# Altium schematic sheet Connect.SchDoc
size A4; SheetNumber: 4; SheetTotal: 4
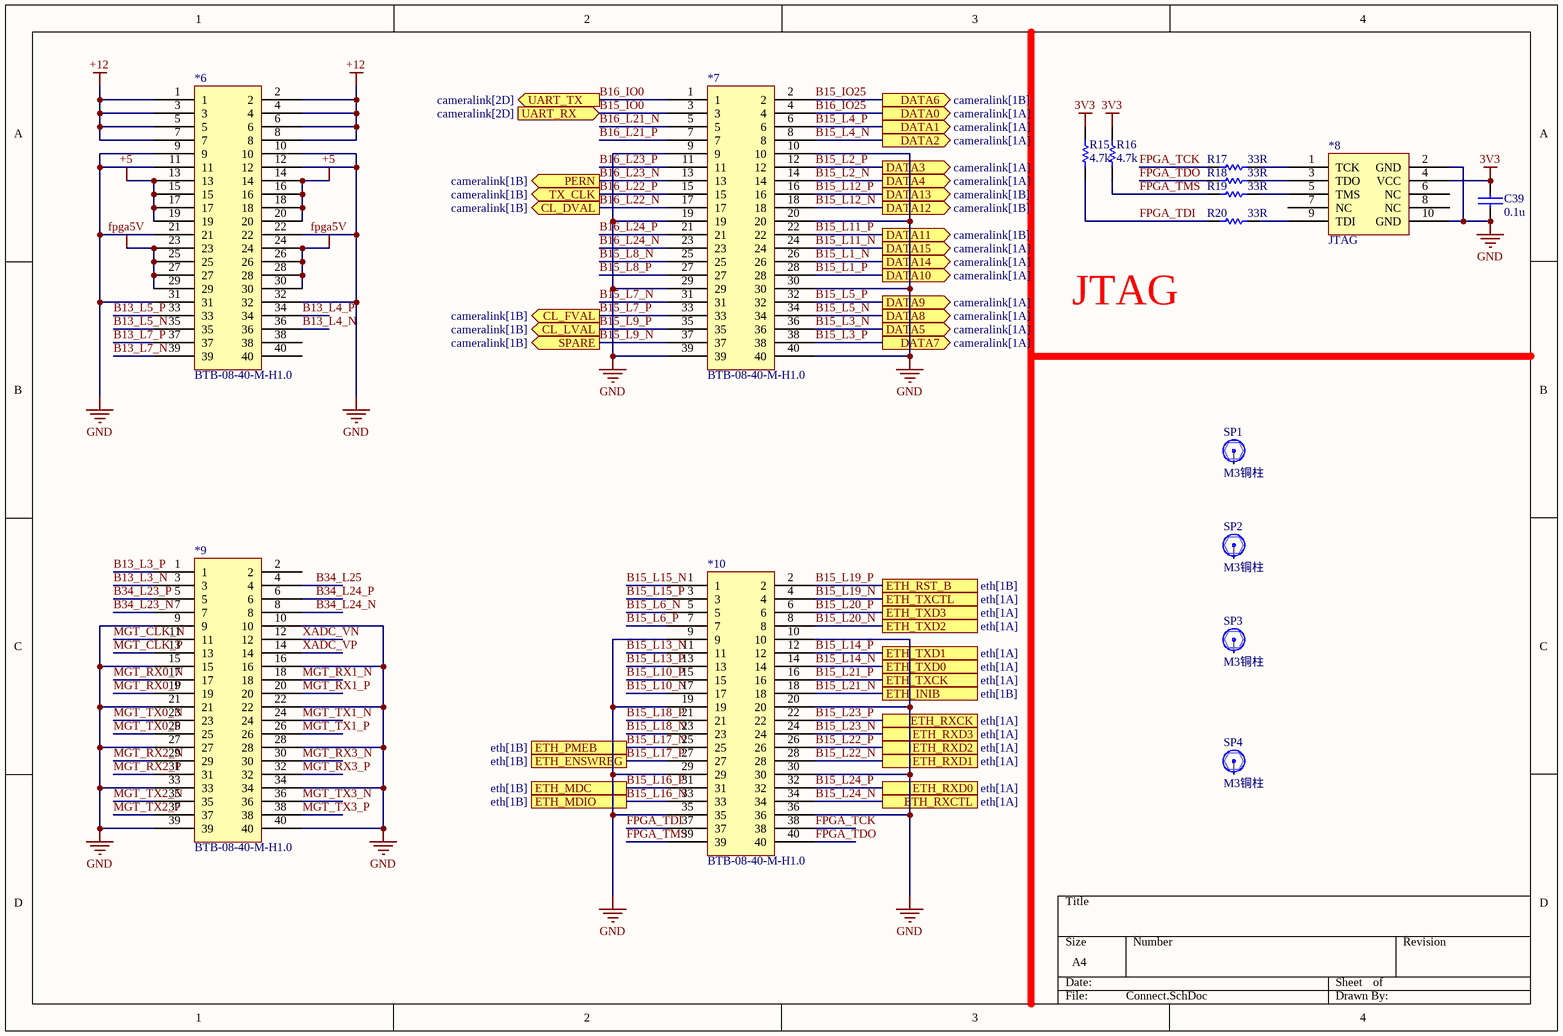
[diagram p0: Connect.SchDoc]

## Parts
*6  BTB-08-40-M-H1.0  [BTB-08-40-M-H1.0]
*7  BTB-08-40-M-H1.0  [BTB-08-40-M-H1.0]
*8  JTAG  [IDC-TH_10P-P2.54-H-R2-C5-S2.54]
*9  BTB-08-40-M-H1.0  [BTB-08-40-M-H1.0]
*10  BTB-08-40-M-H1.0  [BTB-08-40-M-H1.0]
C39  0.1u  [0603C]
R15  4.7k  [0603R]
R16  4.7k  [0603R]
R17  33R  [0603R]
R18  33R  [0603R]
R19  33R  [0603R]
R20  33R  [0603R]
SP1  M3铜柱  [M3x4_N]
SP2  M3铜柱  [M3x4_N]
SP3  M3铜柱  [M3x4_N]
SP4  M3铜柱  [M3x4_N]

## Ports
CL_DVAL (out, see cameralink[1B]), CL_FVAL (out, see cameralink[1B]), CL_LVAL (out, see cameralink[1B]), DATA0 (out, see cameralink[1A]), DATA1 (out, see cameralink[1A]), DATA2 (out, see cameralink[1A]), DATA3 (out, see cameralink[1A]), DATA4 (out, see cameralink[1A]), DATA5 (out, see cameralink[1A]), DATA6 (out, see cameralink[1B]), DATA7 (out, see cameralink[1A]), DATA8 (out, see cameralink[1A]), DATA9 (out, see cameralink[1A]), DATA10 (out, see cameralink[1A]), DATA11 (out, see cameralink[1B]), DATA12 (out, see cameralink[1B]), DATA13 (out, see cameralink[1B]), DATA14 (out, see cameralink[1A]), DATA15 (out, see cameralink[1A]), ETH_ENSWREG (see eth[1B]), ETH_INIB (see eth[1B]), ETH_MDC (see eth[1B]), ETH_MDIO (see eth[1B]), ETH_PMEB (see eth[1B]), ETH_RST_B (see eth[1B]), ETH_RXCK (see eth[1A]), ETH_RXCTL (see eth[1A]), ETH_RXD0 (see eth[1A]), ETH_RXD1 (see eth[1A]), ETH_RXD2 (see eth[1A]), ETH_RXD3 (see eth[1A]), ETH_TXCK (see eth[1A]), ETH_TXCTL (see eth[1A]), ETH_TXD0 (see eth[1A]), ETH_TXD1 (see eth[1A]), ETH_TXD2 (see eth[1A]), ETH_TXD3 (see eth[1A]), PERN (out, see cameralink[1B]), SPARE (out, see cameralink[1B]), TX_CLK (out, see cameralink[1B]), UART_RX (in, see cameralink[2D]), UART_TX (out, see cameralink[2D])

## Nets
3V3: *8.4(VCC) C39.2 R15.2 R16.2
+5: *6.13 *6.14 *6.15 *6.16 *6.17 *6.18 *6.19 *6.20
+12: *6.1 *6.2 *6.3 *6.4 *6.5 *6.6 *6.7 *6.8
fpga5V: *6.23 *6.24 *6.25 *6.26 *6.27 *6.28 *6.29 *6.30
GND: *6.9 *6.10 *6.11 *6.12 *6.21 *6.22 *6.31 *6.32 *7.9 *7.10 *7.19 *7.20 *7.29 *7.30 *7.39 *7.40 *8.2(GND) *8.10(GND) *9.9 *9.10 *9.15 *9.16 *9.21 *9.22 *9.27 *9.28 *9.33 *9.34 *9.39 *9.40 *10.9 *10.10 *10.19 *10.20 *10.29 *10.30 *10.35 *10.36 C39.1
B13_L3_N: *9.3
B13_L3_P: *9.1
B13_L4_N: *6.36
B13_L4_P: *6.34
B13_L5_N: *6.35
B13_L5_P: *6.33
B13_L7_N: *6.39
B13_L7_P: *6.37
B15_IO0: *7.3 ; port UART_RX
B15_IO25: *7.2 ; port DATA6
B15_L1_N: *7.26 ; port DATA14
B15_L1_P: *7.28 ; port DATA10
B15_L2_N: *7.14 ; port DATA4
B15_L2_P: *7.12 ; port DATA3
B15_L3_N: *7.36 ; port DATA5
B15_L3_P: *7.38 ; port DATA7
B15_L4_N: *7.8 ; port DATA2
B15_L4_P: *7.6 ; port DATA1
B15_L5_N: *7.34 ; port DATA8
B15_L5_P: *7.32 ; port DATA9
B15_L6_N: *10.5
B15_L6_P: *10.7
B15_L7_N: *7.31
B15_L7_P: *7.33 ; port CL_FVAL
B15_L8_N: *7.25
B15_L8_P: *7.27
B15_L9_N: *7.37 ; port SPARE
B15_L9_P: *7.35 ; port CL_LVAL
B15_L10_N: *10.17
B15_L10_P: *10.15
B15_L11_N: *7.24 ; port DATA15
B15_L11_P: *7.22 ; port DATA11
B15_L12_N: *7.18 ; port DATA12
B15_L12_P: *7.16 ; port DATA13
B15_L13_N: *10.11
B15_L13_P: *10.13
B15_L14_N: *10.14 ; port ETH_TXD0
B15_L14_P: *10.12 ; port ETH_TXD1
B15_L15_N: *10.1
B15_L15_P: *10.3
B15_L16_N: *10.33 ; port ETH_MDIO
B15_L16_P: *10.31 ; port ETH_MDC
B15_L17_N: *10.25 ; port ETH_PMEB
B15_L17_P: *10.27 ; port ETH_ENSWREG
B15_L18_N: *10.23
B15_L18_P: *10.21
B15_L19_N: *10.4 ; port ETH_TXCTL
B15_L19_P: *10.2 ; port ETH_RST_B
B15_L20_N: *10.8 ; port ETH_TXD2
B15_L20_P: *10.6 ; port ETH_TXD3
B15_L21_N: *10.18 ; port ETH_INIB
B15_L21_P: *10.16 ; port ETH_TXCK
B15_L22_N: *10.28 ; port ETH_RXD1
B15_L22_P: *10.26 ; port ETH_RXD2
B15_L23_N: *10.24 ; port ETH_RXD3
B15_L23_P: *10.22 ; port ETH_RXCK
B15_L24_N: *10.34 ; port ETH_RXCTL
B15_L24_P: *10.32 ; port ETH_RXD0
B16_IO0: *7.1 ; port UART_TX
B16_IO25: *7.4 ; port DATA0
B16_L21_N: *7.5
B16_L21_P: *7.7
B16_L22_N: *7.17 ; port CL_DVAL
B16_L22_P: *7.15 ; port TX_CLK
B16_L23_N: *7.13 ; port PERN
B16_L23_P: *7.11
B16_L24_N: *7.23
B16_L24_P: *7.21
B34_L23_N: *9.7
B34_L23_P: *9.5
B34_L24_N: *9.8
B34_L24_P: *9.6
B34_L25: *9.4
FPGA_TCK: *10.38 R17.1
FPGA_TDI: *10.37 R15.1 R20.1
FPGA_TDO: *10.40 R18.1
FPGA_TMS: *10.39 R16.1 R19.1
MGT_CLK_N: *9.11
MGT_CLK_P: *9.13
MGT_RX0_N: *9.17
MGT_RX0_P: *9.19
MGT_RX1_N: *9.18
MGT_RX1_P: *9.20
MGT_RX2_N: *9.29
MGT_RX2_P: *9.31
MGT_RX3_N: *9.30
MGT_RX3_P: *9.32
MGT_TX0_N: *9.23
MGT_TX0_P: *9.25
MGT_TX1_N: *9.24
MGT_TX1_P: *9.26
MGT_TX2_N: *9.35
MGT_TX2_P: *9.37
MGT_TX3_N: *9.36
MGT_TX3_P: *9.38
XADC_VN: *9.12
XADC_VP: *9.14
Net*8_1: *8.1(TCK) R17.2
Net*8_3: *8.3(TDO) R18.2
Net*8_5: *8.5(TMS) R19.2
Net*8_9: *8.9(TDI) R20.2

Not connected (* = marked no-connect by the designer): *6 38 40; *8 6(NC) 7(NC) 8(NC); *9 2; SP1 1; SP2 1; SP3 1; SP4 1

## Notes on the sheet
- JTAG

## Library data of the parts
C39 = CAP: 无极性电容
R15-R20 = RES: 电阻
SP1-SP4 = 铜柱大焊盘: 铜柱; 版权归属: 封装库来自淘宝 ID：黄晶宝石; BOM名称: 铜柱; 学习资源: https://shop463601444.taobao.com